# Altium project Programmer_Debugger_for_ESP32.PrjPcb
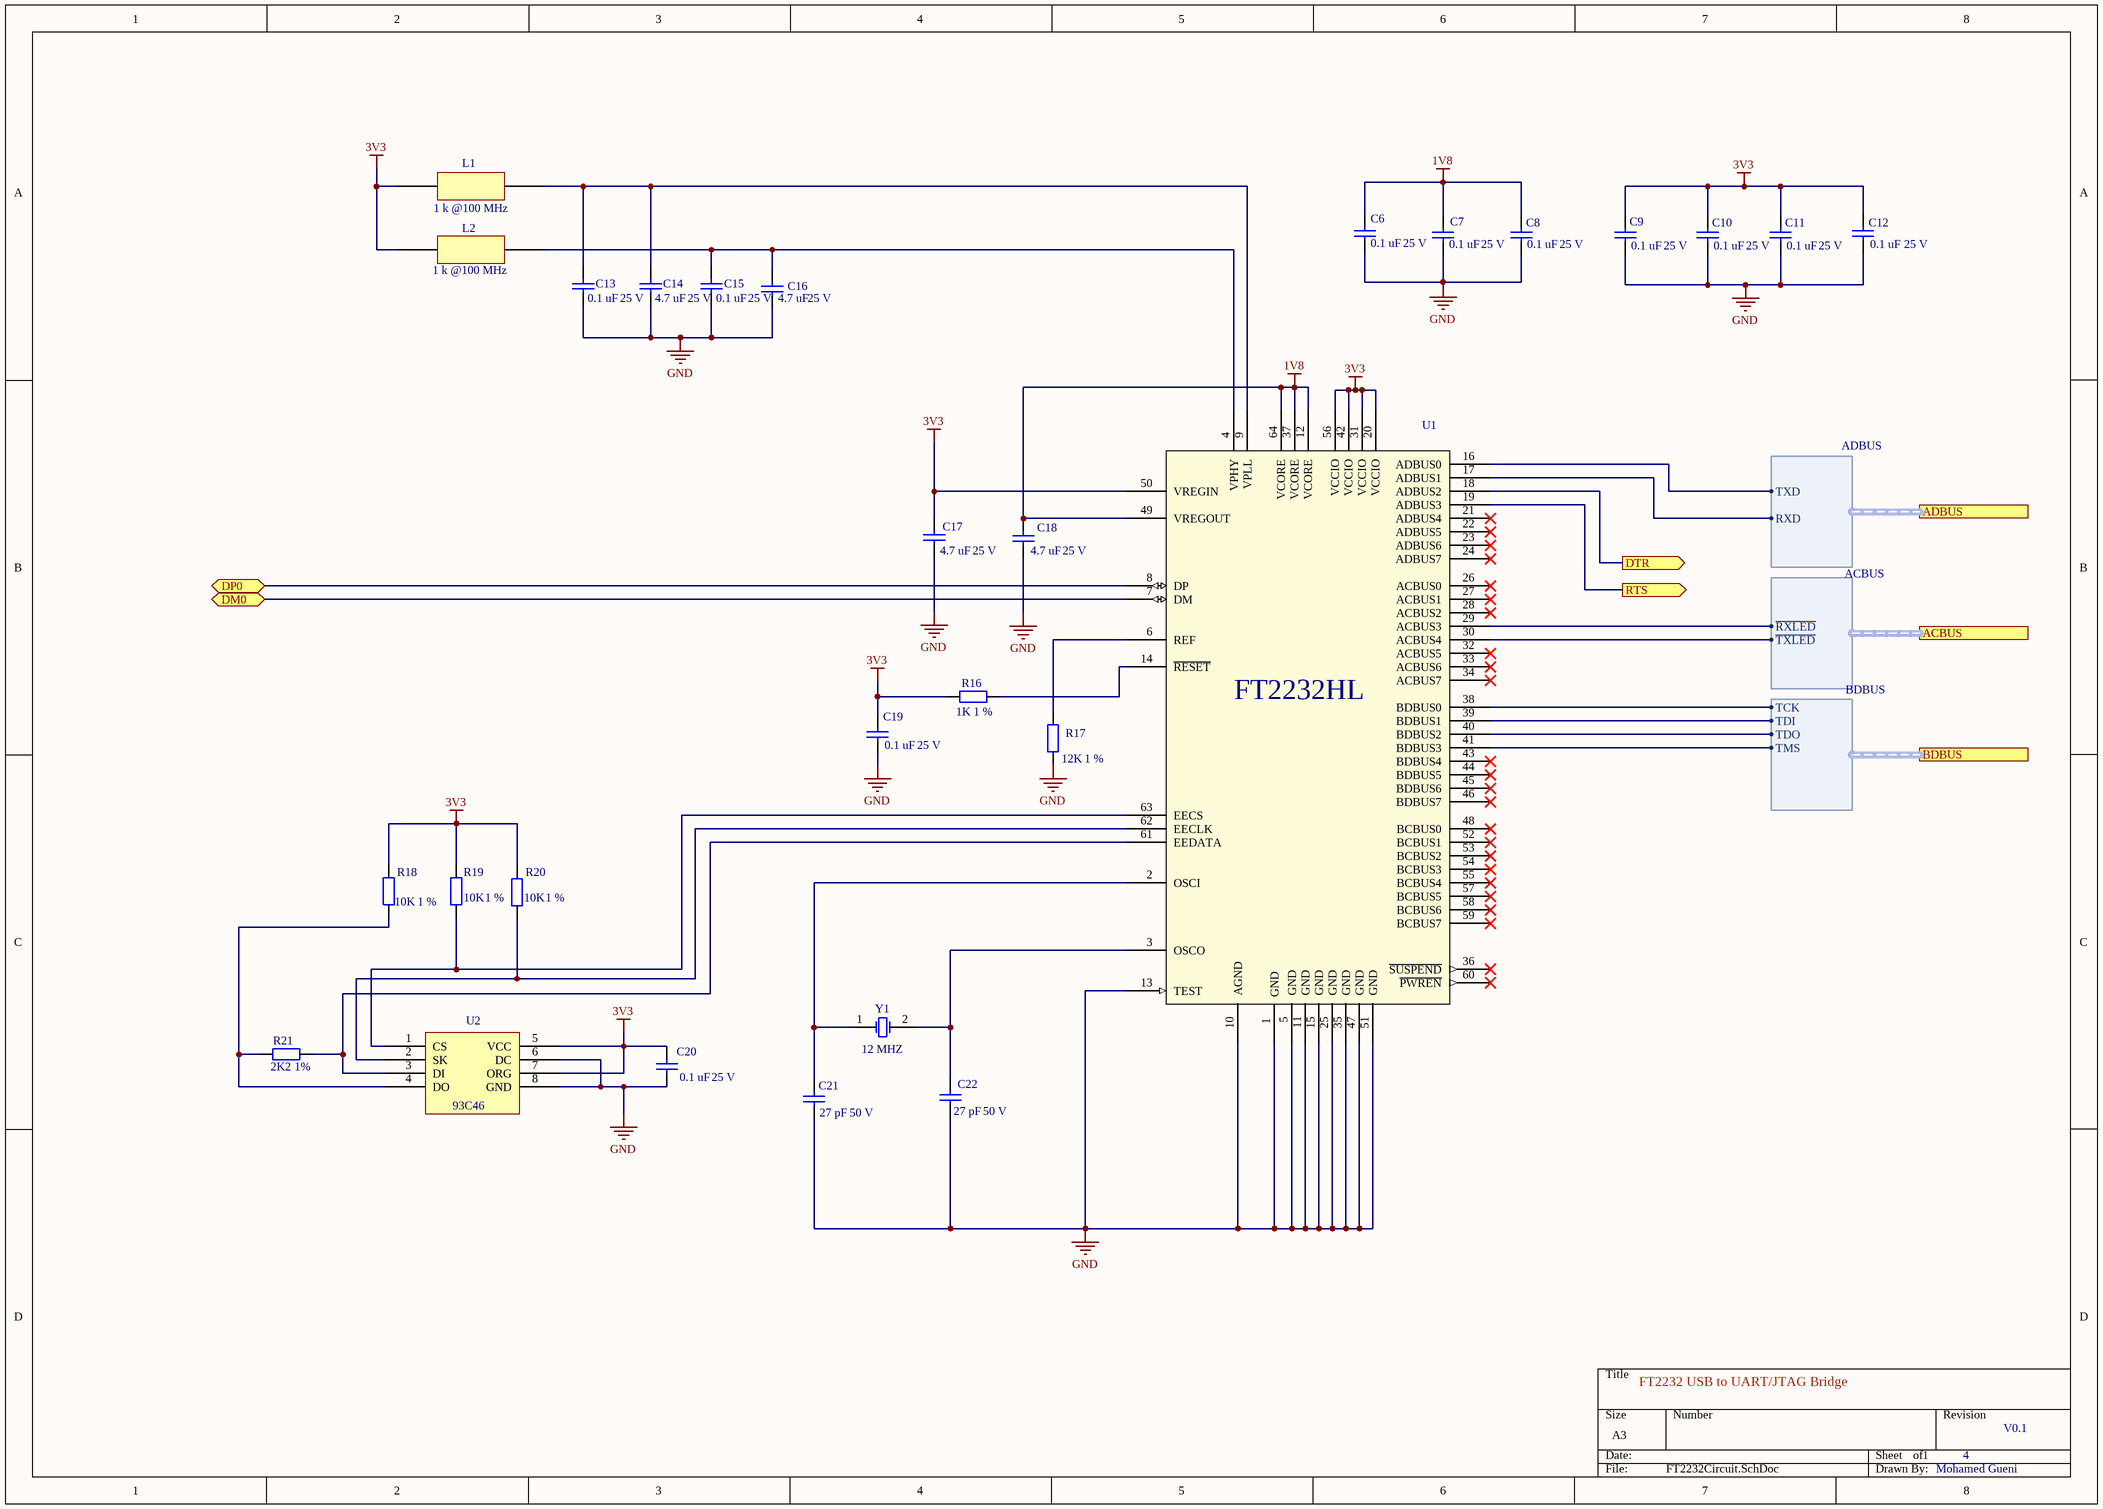
[diagram p0: FT2232Circuit.SchDoc]
3 sheets, 59 parts. Net scope: flat (ports and power ports of the same name join across sheets).
Board file: PCB1.PcbDoc
Sheets:
  FT2232Circuit.SchDoc
  USBandPOWER.SchDoc
  ConnectorsCircuit.SchDoc

## Sheet FT2232Circuit.SchDoc
size A3

### Parts
C6  Value 1: 0.1 uF  Value 2: 25 V  [CAP0603]  (hidden comment: Capacitor)
C7  Value 1: 0.1 uF  Value 2: 25 V  [CAP0603]  (hidden comment: Capacitor)
C8  Value 1: 0.1 uF  Value 2: 25 V  [CAP0603]  (hidden comment: Capacitor)
C9  Value 1: 0.1 uF  Value 2: 25 V  [CAP0603]  (hidden comment: Capacitor)
C10  Value 1: 0.1 uF  Value 2: 25 V  [CAP0603]  (hidden comment: Capacitor)
C11  Value 1: 0.1 uF  Value 2: 25 V  [CAP0603]  (hidden comment: Capacitor)
C12  Value 1: 0.1 uF  Value 2: 25 V  [CAP0603]  (hidden comment: Capacitor)
C13  Value 1: 0.1 uF  Value 2: 25 V  [CAP0603]  (hidden comment: Capacitor)
C14  Value 1: 4.7 uF  Value 2: 25 V  [CAP0603]  (hidden comment: Capacitor)
C15  Value 1: 0.1 uF  Value 2: 25 V  [CAP0603]  (hidden comment: Capacitor)
C16  Value 1: 4.7 uF  Value 2: 25 V  [CAP0603]  (hidden comment: Capacitor)
C17  Value 1: 4.7 uF  Value 2: 25 V  [CAP0603]  (hidden comment: Capacitor)
C18  Value 1: 4.7 uF  Value 2: 25 V  [CAP0603]  (hidden comment: Capacitor)
C19  Value 1: 0.1 uF  Value 2: 25 V  [CAP0603]  (hidden comment: Capacitor)
C20  Value 1: 0.1 uF  Value 2: 25 V  [CAP0603]  (hidden comment: Capacitor)
C21  Value 1: 27 pF  Value 2: 50 V  [CAP0603]  (hidden comment: Capacitor)
C22  Value 1: 27 pF  Value 2: 50 V  [CAP0603]  (hidden comment: Capacitor)
L1  Value 1: 1 k @100 MHz  [RESC3216X18N]  (hidden comment: Ferrit Bead)
L2  Value 1: 1 k @100 MHz  [RESC3216X18N]  (hidden comment: Ferrit Bead)
R16  Value 1: 1K  TOL: 1 %  [RES0603]  (hidden comment: Resistor)
R17  Value 1: 12K  TOL: 1 %  [RES0603]  (hidden comment: Resistor)
R18  Value 1: 10K  TOL: 1 %  [RES0603]  (hidden comment: Resistor)
R19  Value 1: 10K  TOL: 1 %  [RES0603]  (hidden comment: Resistor)
R20  Value 1: 10K  TOL: 1 %  [RES0603]  (hidden comment: Resistor)
R21  Value 1: 2K2  TOL: 1%  [RES0603]  (hidden comment: Resistor)
U1  FT2232HL-REEL  [TSQFP50P1200X1200X160-64N]  (value not drawn)
U2  93C46  [SOIC127P600X175-8N]  (value not drawn)
Y1  Value 1: 12 MHZ  [ABLS-12.000MHZ-B2]  (hidden comment: XTAL)

### Ports
ACBUS (harness ACBUS), ADBUS (harness ADBUS), BDBUS (harness BDBUS), DM0 (bidir), DP0 (bidir), DTR (out), RTS (out)

### Harnesses
ADBUS: TXD, RXD
ACBUS: ~{RXLED}, ~{TXLED}
BDBUS: TCK, TDI, TDO, TMS

### Nets
1V8: C6.2 C7.2 C8.2 C18.2 U1.12(VCORE) U1.37(VCORE) U1.49(VREGOUT) U1.64(VCORE)
3V3: C9.2 C10.2 C11.2 C12.2 C17.2 C19.2 C20.2 L1.2 L2.2 R16.1 R18.2 R19.2 R20.2 U1.20(VCCIO) U1.31(VCCIO) U1.42(VCCIO) U1.50(VREGIN) U1.56(VCCIO) U2.5(VCC) U2.7(ORG)
GND: C6.1 C7.1 C8.1 C9.1 C10.1 C11.1 C12.1 C13.1 C14.1 C15.1 C16.1 C17.1 C18.1 C19.1 C20.1 C21.1 C22.1 R17.1 U1.1(GND) U1.5(GND) U1.10(AGND) U1.11(GND) U1.13(TEST) U1.15(GND) U1.25(GND) U1.35(GND) U1.47(GND) U1.51(GND) U2.6(DC) U2.8(GND)
ESP-RXD: U1.17(ADBUS1) ; port ADBUS.RXD
ESP-TCK: U1.38(BDBUS0) ; port BDBUS.TCK
ESP-TDI: U1.39(BDBUS1) ; port BDBUS.TDI
ESP-TDO: U1.40(BDBUS2) ; port BDBUS.TDO
ESP-TMS: U1.41(BDBUS3) ; port BDBUS.TMS
ESP-TXD: U1.16(ADBUS0) ; port ADBUS.TXD
NetC13_2: C13.2 C14.2 L1.1 U1.9(VPLL)
NetC15_2: C15.2 C16.2 L2.1 U1.4(VPHY)
NetC21_2: C21.2 U1.2(OSCI) Y1.1(OSC1)
NetC22_2: C22.2 U1.3(OSCO) Y1.2(OSC2)
NetD1_3: U1.29(ACBUS3) ; port ACBUS.~{RXLED}
NetD1_4: U1.30(ACBUS4) ; port ACBUS.~{TXLED}
NetR16_2: R16.2 U1.14(~{RESET})
NetR17_2: R17.2 U1.6(REF)
NetR18_1: R18.1 R21.1 U2.4(DO)
NetR19_1: R19.1 U1.63(EECS) U2.1(CS)
NetR20_1: R20.1 U1.62(EECLK) U2.2(SK)
NetR21_2: R21.2 U1.61(EEDATA) U2.3(DI)
NetU1_7: U1.7(DM) ; port DM0
NetU1_8: U1.8(DP) ; port DP0
NetU1_18: U1.18(ADBUS2) ; port DTR
NetU1_19: U1.19(ADBUS3) ; port RTS

Not connected (* = marked no-connect by the designer): U1 21(ADBUS4)* 22(ADBUS5)* 23(ADBUS6)* 24(ADBUS7)* 26(ACBUS0)* 27(ACBUS1)* 28(ACBUS2)* 32(ACBUS5)* 33(ACBUS6)* 34(ACBUS7)* 36(~{SUSPEND})* 43(BDBUS4)* 44(BDBUS5)* 45(BDBUS6)* 46(BDBUS7)* 48(BCBUS0)* 52(BCBUS1)* 53(BCBUS2)* 54(BCBUS3)* 55(BCBUS4)* 57(BCBUS5)* 58(BCBUS6)* 59(BCBUS7)* 60(~{PWREN})*

### Notes on the sheet
- FT2232 USB to UART/JTAG Bridge
- 1
- 4
- V0.1
- Mohamed Gueni
- (in symbol U-001) FT2232HL

### Library data of the parts
C6-C13 C15 C19 C20 = CAP-0005: DES: Multilayer Ceramic Capacitors MLCC - SMD/SMT SOFT 0603 25V 0.1uF X8R 10% AEC-Q200; MAN: TDK; MANREF: CGA3E2X8R1E104K080AE; SUP: Mouser; SUPREF: 810-CGA3E2X8R1E104KA; TOL: 10 %; N°: CAP-0005; Footprint: 0603; DataSheet: https://eu.mouser.com/datasheet/2/400/lcc_automotive_soft_en-843922.pdf
C14 C16-C18 = CAP-0001: DES: Multilayer Ceramic Capacitors MLCC - SMD/SMT 0603 25Vdc 4.7uF X6S 10%; MAN: Murata Electronics; MANREF: GRT188C81E475KE13D; SUP: Mouser; SUPREF: 81-GRT188C81E475KE3D; TOL: 10%; N°: CAP-0001; Footprint: 0603; DataSheet: https://eu.mouser.com/datasheet/2/281/product-794242.pdf
C21 C22 = CAP-0017: DES: Multilayer Ceramic Capacitors MLCC - SMD/SMT 50V 27pF 0603 X7R 5%; MAN: KEMET; MANREF: C0603C270J5RACTU; SUP: Mouser; SUPREF: 80-C0603C270J5R; TOL: 5 %; N°: CAP-0017; Footprint: 0603; DataSheet: https://eu.mouser.com/datasheet/2/212/KEM_C1002_X7R_SMD-1102033.pdf
L1 L2 = L-0001: N°: L-0001; DES: Ferrite Beads 1000ohms 0.3ohms 0.8A; MAN: TDK; MANREF: MPZ1608S102A; SUP: Mouser; SUPREF: 810-MPZ1608S102A; Value 2: 800 mA; Footprint: 0603 (1608 metric); DataSheet: https://eu.mouser.com/datasheet/2/400/eads_commercial_power_mpz1608_en-923650.pdf
R16 = RES-0001: DES: Thick Film Resistors - SMD 0603 1K 1% High VoltageAEC-Q200; MAN: ROHM Semiconductor; MANREF: KTR03EZPF1001; SUP: Mouser; SUPREF: 755-KTR03EZPF1001; N°: RES-0001; DataSheet: https://eu.mouser.com/datasheet/2/348/ktr-e-1139187.pdf; Footprint: 0603
R17 = RES-0010: DES: Thick Film Resistors - SMD 0603 12K 1%; MAN: Kamaya / Kamaya; MANREF: RMC1/16K1202FTP; SUP: Mouser; SUPREF: 791-RMC1/16-123FTP; Value 2: 100 mW; N°: RES-0010; DataSheet: https://eu.mouser.com/datasheet/2/210/kamaya_products(RMC)_english_20170424_100617-1524908.pdf; Footprint: 0603
R18-R20 = RES-0011: DES: Thick Film Resistors - SMD 0603 10K 1%; MAN: Kamaya / Kamaya; MANREF: RMC1/16K1002FTP; SUP: Mouser; SUPREF: 791-RMC1/16-103FTP; Value 2: 100 mW; N°: RES-0011; DataSheet: https://eu.mouser.com/datasheet/2/210/kamaya_products(RMC)_english_20170424_100617-1524908.pdf; Footprint: 0603
R21 = RES-0014: DES: Thick Film Resistors - SMD 1/10Watt 2.2Kohms 5% Commercial Use; MAN: Vishay; MANREF: CRCW06032K20JNEAC; SUP: Mouser; SUPREF: 71-CRCW06032K20JNEAC; Value 2: 100 mW; N°: RES-0014; DataSheet: https://eu.mouser.com/datasheet/2/427/crcwce3-1223726.pdf; Footprint: 0603
U1 = U-001: IC USB HS DUAL UART/FIFO 64-LQFP; N°: U-001; DES: USB Interface IC USB HS to Dual UART/ FIFO/SPI/JTAG/I2C; MAN: FTDI; SUP: Mouser; SUPREF: 895-FT2232HL; DataSheet: https://eu.mouser.com/datasheet/2/163/DS_FT2232H-17353.pdf; MANREF: FT2232HL-REEL; Footprint: LQFP-64
U2 = U-002: EEPROM 64x16; N°: U-002; MAN: Microchip Technology; MANREF: 93C46B-I/SN; SUP: Mouser; SUPREF: 579-93C46B-I/SN; DES: EEPROM 64x16; DataSheet: https://eu.mouser.com/datasheet/2/268/20001749K-277859.pdf; Footprint: SOIC-8
Y1 = Y-0001: Crystal Oscillator; N°: Y-0001; TOL: 20 PPM; DES: Crystals +/-20ppm 12 MHZ FUNDAMENTAL; MAN: ABRACON / Ecliptek; MANREF: ABLS-12.000MHZ-B2-T; SUP: Mouser; SUPREF: 815-ABLS-12-B2; Value 2: 18 pF; Published: 8-Jun-2000; LatestRevisionDate: 17-Jul-2002; LatestRevisionNote: Re-released for DXP Platform.; PackageReference: R38; Publisher: Altium Limited; PackageDescription: Crystal, Thru-Hole; 2 Leads; Body 3.1 x 8.2 mm (Dia.xH); Footprint: HC-49/US; DataSheet: https://eu.mouser.com/datasheet/2/3/abls-44621.pdf

## Sheet USBandPOWER.SchDoc
size A4
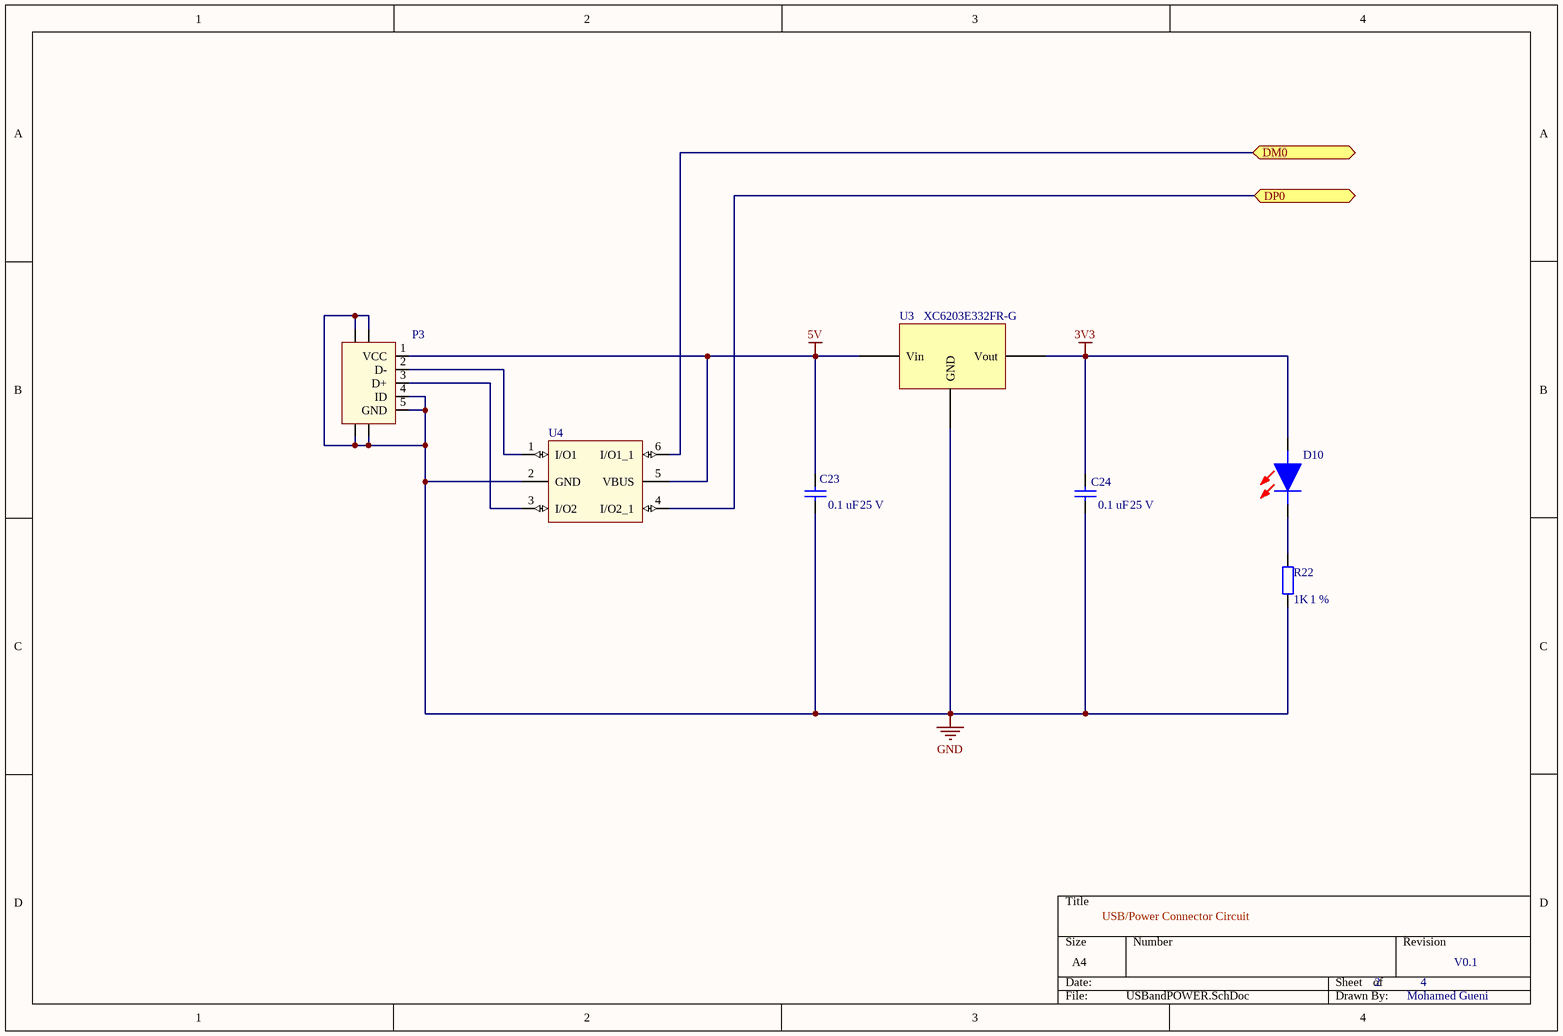
[diagram p1: USBandPOWER.SchDoc]

### Parts
C23  Value 1: 0.1 uF  Value 2: 25 V  [CAP0603]  (hidden comment: Capacitor)
C24  Value 1: 0.1 uF  Value 2: 25 V  [CAP0603]  (hidden comment: Capacitor)
D10  SML-H12U8TT86C  [LEDC2012X90N]  (value not drawn)
P3  USB_minB  [51387-0530]  (value not drawn)
R22  Value 1: 1K  TOL: 1 %  [RES0603]  (hidden comment: Resistor)
U3  MANREF: XC6203E332FR-G  [REG-SOT230P700X180-4N]  (hidden comment: Voltage Regulator)
U4  USBLC6-2SC6  [SOT95P280X145]  (value not drawn)

### Ports
DM0 (bidir), DP0 (bidir)

### Nets
3V3: C24.2 D10.2(A) U3.3(Vout)
5V: C23.2 P3.1(VCC) U3.2(Vin) U4.5(VBUS)
GND: C23.1 C24.1 P3.4(ID) P3.5(GND) P3.SH1(SHIELD) P3.SH2(SHIELD) P3.SH3(SHIELD) P3.SH4(SHIELD) R22.1 U3.1(GND) U4.2(GND)
NetD10_1: D10.1(K) R22.2
NetP3_2: P3.2(D-) U4.1(I/O1)
NetP3_3: P3.3(D+) U4.3(I/O2)
NetU1_7: U4.6(I/O1_1) ; port DM0
NetU1_8: U4.4(I/O2_1) ; port DP0

### Notes on the sheet
- USB/Power Connector Circuit
- 2
- 4
- V0.1
- Mohamed Gueni

### Library data of the parts
C23 C24 = CAP-0005: as C6 on sheet FT2232Circuit; N°: CAP-0005; Footprint: 0603; DataSheet: https://eu.mouser.com/datasheet/2/400/lcc_automotive_soft_en-843922.pdf
D10 = LED-0002: ROHM - SML-H12U8TT86C - CHIP LED, AEC-Q101, RED, 40MCD, 0805; Manufacturer_Name: ROHM Semiconductor; Geometry.Height: 0.9mm; DES: Standard LEDs - SMD Red 620nm 40mcd 2.2V; 20mA; 0603; SUP: Mouser; SUPREF: 755-SML-H12U8TT86C; Value 1: 20 mA; Value 2: 2.2 V; Mouser Part Number: 755-SML-H12U8TT86C; Mouser Price/Stock: https://www.mouser.com/Search/Refine.aspx?Keyword=755-SML-H12U8TT86C; Manufacturer_Part_Number: SML-H12U8TT86C; Datasheet Link: https://componentsearchengine.com/Datasheets/1/SML-H12U8TT86C.pdf; N°: LED-0002; MAN: ROHM Semiconductor; MANREF: SML-H12U8TT86C; Footprint: 0805 (2012 metric); DataSheet: https://eu.mouser.com/datasheet/2/348/sml-h1(c)-e-1508182.pdf
P3 = P-0002: N°: P-0002; DES: DataBase\PCBLibrary.PcbLib; MAN: Molex; SUP: Mouser; SUPREF: 538-51387-0530; MANREF: 51387-0530; Footprint: THT; DataSheet: https://eu.mouser.com/datasheet/2/276/0513870530_IO_CONNECTORS-170392.pdf
R22 = RES-0001: as R16 on sheet FT2232Circuit; N°: RES-0001; DataSheet: https://eu.mouser.com/datasheet/2/348/ktr-e-1139187.pdf; Footprint: 0603
U3 = U-003: N°: U-003; DES: LDO Voltage Regulators; MAN: Torex Semiconductor; SUP: Mouser; SUPREF: 865-XC6203E332FR-G; Value 2: 8 V; Value 1: 3.3 V; DataSheet: https://eu.mouser.com/datasheet/2/760/XC6203-846590.pdf; Footprint: SOT-223-3
U4 = U-005: TVS Diode Array Uni-Directional USBLC6-2SC6 17V, SOT-23 6-Pin; Manufacturer_Name: STMicroelectronics; Geometry.Height: 1.45mm; N°: U-005; DES: ESD Suppressors / TVS Diodes ESD Protection Low Cap; SUP: Mouser; SUPREF: 511-USBLC6-2SC6; Mouser Part Number: 511-USBLC6-2SC6; Mouser Price/Stock: https://www.mouser.com/Search/Refine.aspx?Keyword=511-USBLC6-2SC6; Manufacturer_Part_Number: USBLC6-2SC6; Datasheet Link: https://componentsearchengine.com/Datasheets/1/USBLC6-2SC6.pdf; MAN: STMicroelectronics; DataSheet: https://eu.mouser.com/datasheet/2/389/usblc6-2-957370.pdf; MANREF: USBLC6-2SC6; Footprint: SOT-666

## Sheet ConnectorsCircuit.SchDoc
size A4
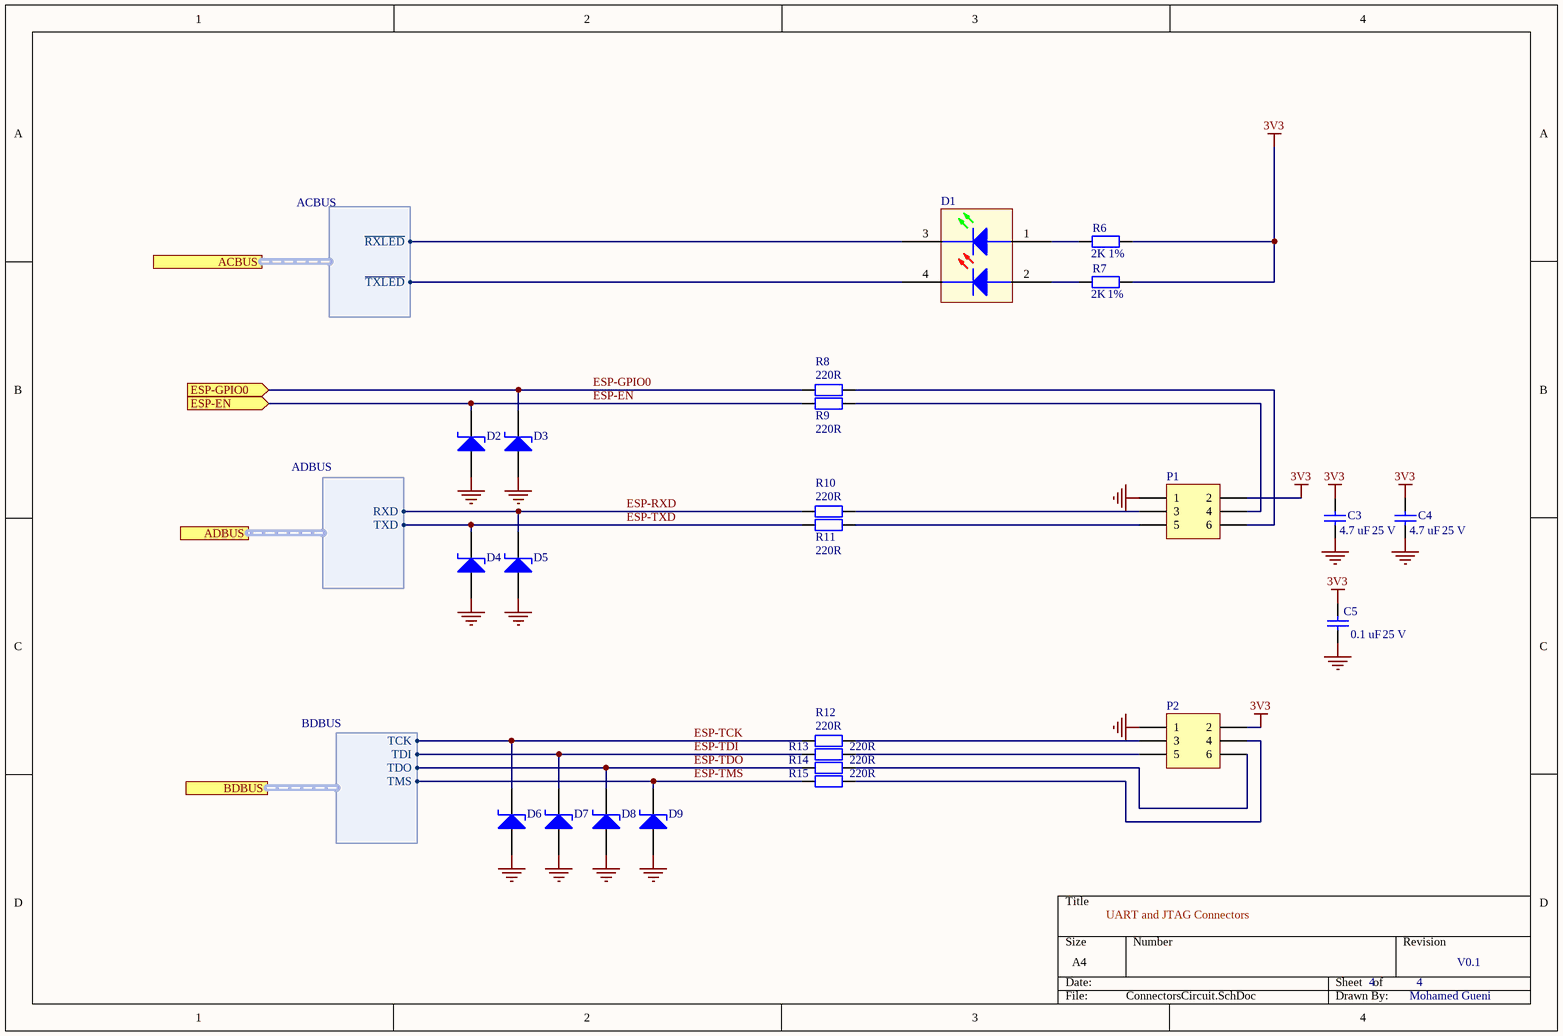
[diagram p2: ConnectorsCircuit.SchDoc]

### Parts
C3  Value 1: 4.7 uF  Value 2: 25 V  [CAP0603]  (hidden comment: Capacitor)
C4  Value 1: 4.7 uF  Value 2: 25 V  [CAP0603]  (hidden comment: Capacitor)
C5  Value 1: 0.1 uF  Value 2: 25 V  [CAP0603]  (hidden comment: Capacitor)
D1  LTST-C155KGJRKT  [LTSTC155KGJRKT]  (value not drawn)
D2  ESD8351HT1G  [SOD-323]  (value not drawn)
D3  ESD8351HT1G  [SOD-323]  (value not drawn)
D4  ESD8351HT1G  [SOD-323]  (value not drawn)
D5  ESD8351HT1G  [SOD-323]  (value not drawn)
D6  ESD8351HT1G  [SOD-323]  (value not drawn)
D7  ESD8351HT1G  [SOD-323]  (value not drawn)
D8  ESD8351HT1G  [SOD-323]  (value not drawn)
D9  ESD8351HT1G  [SOD-323]  (value not drawn)
P1  Header 3X2  [SHDR6W75P200_2X3_865X640X650P]  (value not drawn)
P2  Header 3X2  [SHDR6W75P200_2X3_865X640X650P]  (value not drawn)
R6  Value 1: 2K  TOL: 1%  [RESC2012X65N2k]  (hidden comment: Resistor)
R7  Value 1: 2K  TOL: 1%  [RESC2012X65N2k]  (hidden comment: Resistor)
R8  Value 1: 220R  [RES0603]  (hidden comment: Resistor)
R9  Value 1: 220R  [RES0603]  (hidden comment: Resistor)
R10  Value 1: 220R  [RES0603]  (hidden comment: Resistor)
R11  Value 1: 220R  [RES0603]  (hidden comment: Resistor)
R12  Value 1: 220R  [RES0603]  (hidden comment: Resistor)
R13  Value 1: 220R  [RES0603]  (hidden comment: Resistor)
R14  Value 1: 220R  [RES0603]  (hidden comment: Resistor)
R15  Value 1: 220R  [RES0603]  (hidden comment: Resistor)

### Ports
ACBUS (harness ACBUS), ADBUS (harness ADBUS), BDBUS (harness BDBUS), ESP-EN (in), ESP-GPIO0 (in)

### Harnesses
ADBUS: RXD, TXD
ACBUS: ~{RXLED}, ~{TXLED}
BDBUS: TCK, TDI, TDO, TMS

### Nets
3V3: C3.2 C4.2 C5.2 P1.2 P2.2 R6.2 R7.2
GND: C3.1 C4.1 C5.1 D2.1 D3.1 D4.1 D5.1 D6.1 D7.1 D8.1 D9.1 P1.1 P2.1
ESP-EN: D2.2(K1A2) R9.1 ; port ESP-EN
ESP-GPIO0: D3.2(K1A2) R8.1 ; port ESP-GPIO0
ESP-RXD: D5.2(K1A2) R10.1 ; port ADBUS.RXD
ESP-TCK: D6.2(K1A2) R12.1 ; port BDBUS.TCK
ESP-TDI: D7.2(K1A2) R13.1 ; port BDBUS.TDI
ESP-TDO: D8.2(K1A2) R14.1 ; port BDBUS.TDO
ESP-TMS: D9.2(K1A2) R15.1 ; port BDBUS.TMS
ESP-TXD: D4.2(K1A2) R11.1 ; port ADBUS.TXD
NetD1_1: D1.1 R6.1
NetD1_2: D1.2 R7.1
NetD1_3: D1.3 ; port ACBUS.~{RXLED}
NetD1_4: D1.4 ; port ACBUS.~{TXLED}
NetP1_3: P1.3 R10.2
NetP1_4: P1.4 R9.2
NetP1_5: P1.5 R11.2
NetP1_6: P1.6 R8.2
NetP2_3: P2.3 R12.2
NetP2_4: P2.4 R15.2
NetP2_5: P2.5 R13.2
NetP2_6: P2.6 R14.2

### Notes on the sheet
- UART and JTAG Connectors
- 4
- V0.1
- Mohamed Gueni

### Library data of the parts
C3 C4 = CAP-0001: as C14 on sheet FT2232Circuit; N°: CAP-0001; Footprint: 0603; DataSheet: https://eu.mouser.com/datasheet/2/281/product-794242.pdf
C5 = CAP-0005: as C6 on sheet FT2232Circuit; N°: CAP-0005; Footprint: 0603; DataSheet: https://eu.mouser.com/datasheet/2/400/lcc_automotive_soft_en-843922.pdf
D1 = LED-0001: LTST-C155KGJRKT, Lite-On 571 / 631 nm 2 Green & Red LED, 4-Pin 3125 (1210) SMD package; Geometry.Height: 1.2mm; DES: Standard LEDs - SMD Green/Red Clear; SUP: Mouser; SUPREF: 859-LTST-C155KGJRKT; Value 1: 20 mA; Value 2: 2 V; Mouser Part Number: 859-LTST-C155KGJRKT; Mouser Price/Stock: https://www.mouser.com/Search/Refine.aspx?Keyword=859-LTST-C155KGJRKT; Manufacturer_Name: Lite-On; Manufacturer_Part_Number: LTST-C155KGJRKT; Datasheet Link: https://componentsearchengine.com/Datasheets/1/LTST-C155KGJRKT.pdf; N°: LED-0001; MAN: Lite-On; MANREF: LTST-C155KGJRKT; Footprint: 1311 (3227 metric); DataSheet: https://eu.mouser.com/datasheet/2/239/LTST-C155KGJRKT-1141409.pdf
D2-D9 = D-0001: TVS Unidirectionel; N°: D-0001; DES: ESD Suppressors / TVS Diodes LOW CAP SNAPBACK ESD PROT; MAN: ON Semiconductor; SUP: Mouser; Note: _; SUPREF: 863-ESD8351HT1G; Value 2: 3.3V; DataSheet: https://eu.mouser.com/datasheet/2/308/ESD8351-D-463790.pdf; MANREF: ESD8351HT1G; Footprint: SOD-323-2; Value 1: _; TOL: _
P1 P2 = P-0001: Header, 3-Pin, Dual row; N°: P-0001; DES: Headers & Wire Housings MGrid Hdr Shrd Vt W/ t W/Lck .76AuLF 6Ckt; MAN: Molex / Molex; MANREF: 87833-0620; SUP: Mouser; SUPREF: 538-87833-0620; LatestRevisionDate: 17-Jul-2002; LatestRevisionNote: Re-released for DXP Platform.; Publisher: Altium Limited; Footprint: Through Hole; DataSheet: https://eu.mouser.com/datasheet/2/276/0878330620_PCB_HEADERS-176495.pdf
R6 R7 = RES-0016: DES: Thick Film Resistors 0805 2Kohm 1% Anti Surge AEC-Q200; MAN: ROHM Semiconductor; MANREF: ESR10EZPF2001; SUP: Mouser; SUPREF: 755-ESR10EZPF2001; Value 2: 400 mW; N°: RES-0016; DataSheet: https://eu.mouser.com/datasheet/2/348/esr-e-1139161.pdf; Footprint: 0805
R8-R15 = RES-0018: TOL: 1%; DES: Thick Film Resistors - SMD 1/10Watt 220ohms 1% Commercial Use; MAN: Vishay; MANREF: CRCW0603220RFKEAC; SUP: Mouser; Note: _; SUPREF: 71-CRCW0603220RFKEAC; Value 2: 100mW; N°: RES-0018; DataSheet: https://eu.mouser.com/datasheet/2/427/crcwce3-1223726.pdf; Footprint: 0603

## Nets that join several sheets
3V3: FT2232Circuit (20 pins), USBandPOWER (C24.2 D10.2 U3.3), ConnectorsCircuit (7 pins)
GND: FT2232Circuit (30 pins), USBandPOWER (11 pins), ConnectorsCircuit (13 pins)
ESP-RXD: FT2232Circuit (U1.17), ConnectorsCircuit (D5.2 R10.1)
ESP-TCK: FT2232Circuit (U1.38), ConnectorsCircuit (D6.2 R12.1)
ESP-TDI: FT2232Circuit (U1.39), ConnectorsCircuit (D7.2 R13.1)
ESP-TDO: FT2232Circuit (U1.40), ConnectorsCircuit (D8.2 R14.1)
ESP-TMS: FT2232Circuit (U1.41), ConnectorsCircuit (D9.2 R15.1)
ESP-TXD: FT2232Circuit (U1.16), ConnectorsCircuit (D4.2 R11.1)
NetD1_3: FT2232Circuit (U1.29), ConnectorsCircuit (D1.3)
NetD1_4: FT2232Circuit (U1.30), ConnectorsCircuit (D1.4)
NetU1_7: FT2232Circuit (U1.7), USBandPOWER (U4.6)
NetU1_8: FT2232Circuit (U1.8), USBandPOWER (U4.4)